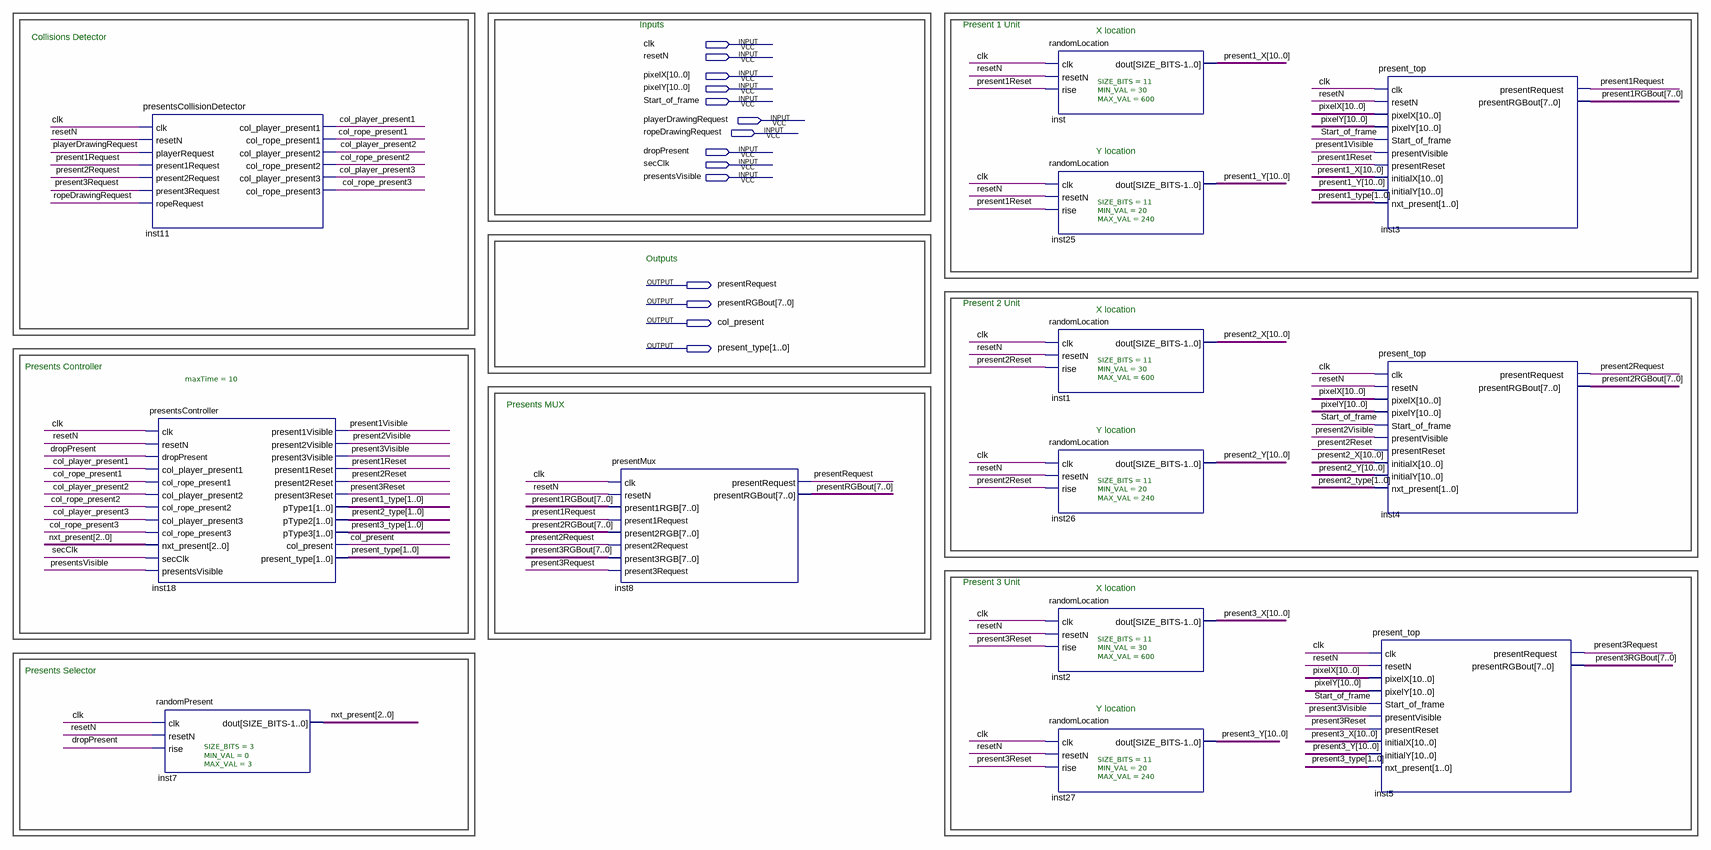
[diagram p0: schematic sheet]
// Quartus schematic Presents_TOP.bdf as structural Verilog: 13 symbols, 14 pins
module Presents_TOP (
  input  clk,
  input  resetN,
  input  [10:0] pixelX,
  input  [10:0] pixelY,
  input  Start_of_frame,
  input  playerDrawingRequest,
  input  ropeDrawingRequest,
  input  dropPresent,
  input  secClk,
  input  presentsVisible,
  output presentRequest,
  output [7:0] presentRGBout,
  output col_present,
  output [1:0] present_type
);

  wire col_player_present1, col_player_present2, col_player_present3, col_rope_present1, col_rope_present2,
       col_rope_present3, present1Request, present1Reset, present1Visible, present2Request, present2Reset,
       present2Visible, present3Request, present3Reset, present3Visible;
  wire [1:0] present1_type, present2_type, present3_type;
  wire [2:0] nxt_present;
  wire [7:0] present1RGBout, present2RGBout, present3RGBout;
  wire [10:0] present1_X, present1_Y, present2_X, present2_Y, present3_X, present3_Y;

  presentsCollisionDetector inst11 (
    .clk(clk), .resetN(resetN), .playerRequest(playerDrawingRequest), .present1Request(present1Request),
    .present2Request(present2Request), .present3Request(present3Request), .ropeRequest(ropeDrawingRequest),
    .col_player_present1(col_player_present1), .col_rope_present1(col_rope_present1),
    .col_player_present2(col_player_present2), .col_rope_present2(col_rope_present2),
    .col_player_present3(col_player_present3), .col_rope_present3(col_rope_present3));
  presentsController #(.maxTime(10)) inst18 (
    .clk(clk), .resetN(resetN), .dropPresent(dropPresent), .col_player_present1(col_player_present1),
    .col_rope_present1(col_rope_present1), .col_player_present2(col_player_present2),
    .col_rope_present2(col_rope_present2), .col_player_present3(col_player_present3),
    .col_rope_present3(col_rope_present3), .nxt_present(nxt_present), .secClk(secClk),
    .presentsVisible(presentsVisible), .present1Visible(present1Visible), .present2Visible(present2Visible),
    .present3Visible(present3Visible), .present1Reset(present1Reset), .present2Reset(present2Reset),
    .present3Reset(present3Reset), .pType1(present1_type), .pType2(present2_type), .pType3(present3_type),
    .col_present(col_present), .present_type(present_type));
  randomPresent #(.SIZE_BITS(3), .MIN_VAL(0), .MAX_VAL(3)) inst7 (
    .clk(clk), .resetN(resetN), .rise(dropPresent), .dout(nxt_present));
  presentMux inst8 (
    .clk(clk), .resetN(resetN), .present1RGB(present1RGBout), .present1Request(present1Request),
    .present2RGB(present2RGBout), .present2Request(present2Request), .present3RGB(present3RGBout),
    .present3Request(present3Request), .presentRequest(presentRequest), .presentRGBout(presentRGBout));
  randomLocation #(.SIZE_BITS(11), .MIN_VAL(30), .MAX_VAL(600)) inst (
    .clk(clk), .resetN(resetN), .rise(present1Reset), .dout(present1_X));
  randomLocation #(.SIZE_BITS(11), .MIN_VAL(20), .MAX_VAL(240)) inst25 (
    .clk(clk), .resetN(resetN), .rise(present1Reset), .dout(present1_Y));
  randomLocation #(.SIZE_BITS(11), .MIN_VAL(30), .MAX_VAL(600)) inst1 (
    .clk(clk), .resetN(resetN), .rise(present2Reset), .dout(present2_X));
  randomLocation #(.SIZE_BITS(11), .MIN_VAL(20), .MAX_VAL(240)) inst26 (
    .clk(clk), .resetN(resetN), .rise(present2Reset), .dout(present2_Y));
  randomLocation #(.SIZE_BITS(11), .MIN_VAL(30), .MAX_VAL(600)) inst2 (
    .clk(clk), .resetN(resetN), .rise(present3Reset), .dout(present3_X));
  randomLocation #(.SIZE_BITS(11), .MIN_VAL(20), .MAX_VAL(240)) inst27 (
    .clk(clk), .resetN(resetN), .rise(present3Reset), .dout(present3_Y));
  present_top inst3 (
    .clk(clk), .resetN(resetN), .pixelX(pixelX), .pixelY(pixelY), .Start_of_frame(Start_of_frame),
    .presentVisible(present1Visible), .presentReset(present1Reset), .initialX(present1_X),
    .initialY(present1_Y), .nxt_present(present1_type), .presentRequest(present1Request),
    .presentRGBout(present1RGBout));
  present_top inst4 (
    .clk(clk), .resetN(resetN), .pixelX(pixelX), .pixelY(pixelY), .Start_of_frame(Start_of_frame),
    .presentVisible(present2Visible), .presentReset(present2Reset), .initialX(present2_X),
    .initialY(present2_Y), .nxt_present(present2_type), .presentRequest(present2Request),
    .presentRGBout(present2RGBout));
  present_top inst5 (
    .clk(clk), .resetN(resetN), .pixelX(pixelX), .pixelY(pixelY), .Start_of_frame(Start_of_frame),
    .presentVisible(present3Visible), .presentReset(present3Reset), .initialX(present3_X),
    .initialY(present3_Y), .nxt_present(present3_type), .presentRequest(present3Request),
    .presentRGBout(present3RGBout));

  // Notes on the sheet:
  //   Inputs
  //   Present 1 Unit
  //   X location
  //   Collisions Detector
  //   Y location
  //   Outputs
  //   Present 2 Unit
  //   X location
  //   Presents Controller
  //   Presents MUX
  //   Y location
  //   Present 3 Unit
  //   X location
  //   Presents Selector
  //   Y location
endmodule
